# Altium schematic sheet loom-front-new.SchDoc
size 594 x 420 mm
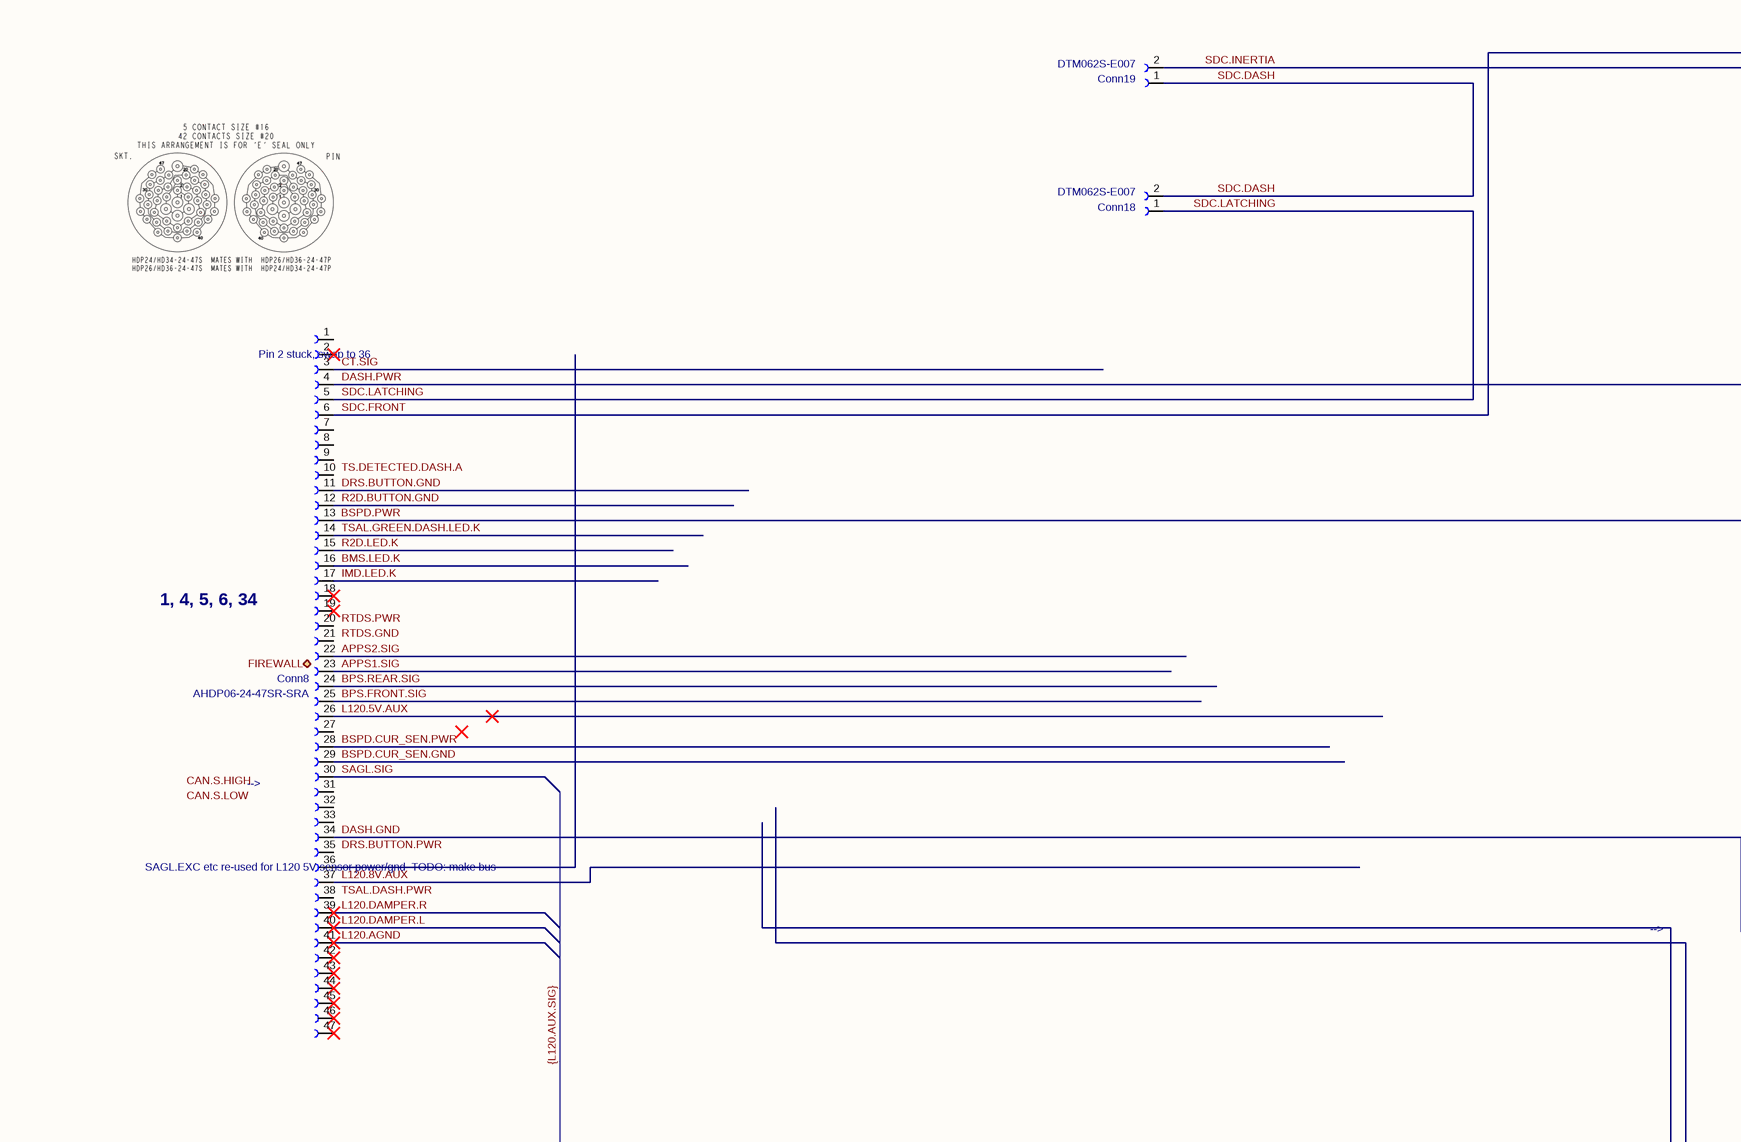
[diagram p0: loom-front-new.SchDoc, top left]
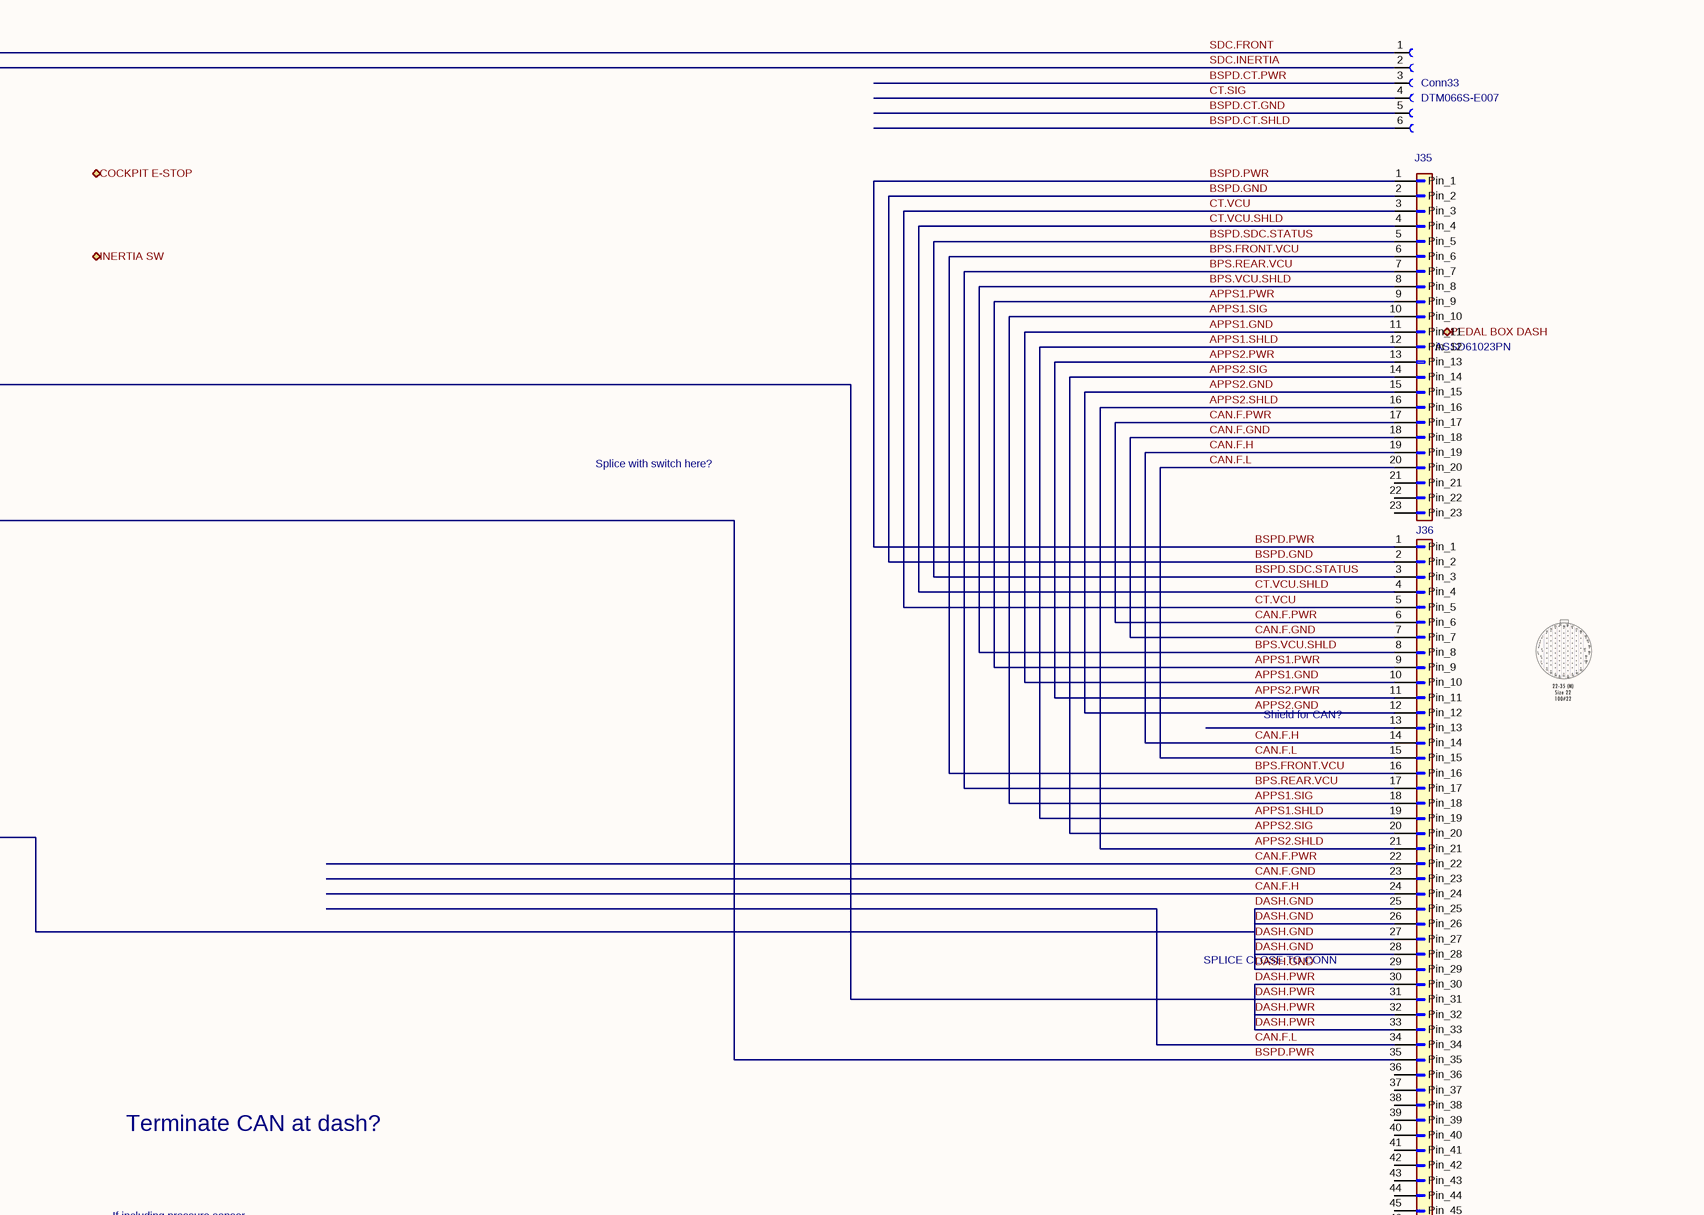
[diagram p1: loom-front-new.SchDoc, top right]
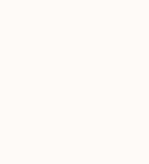
[diagram p2: loom-front-new.SchDoc, bottom left]
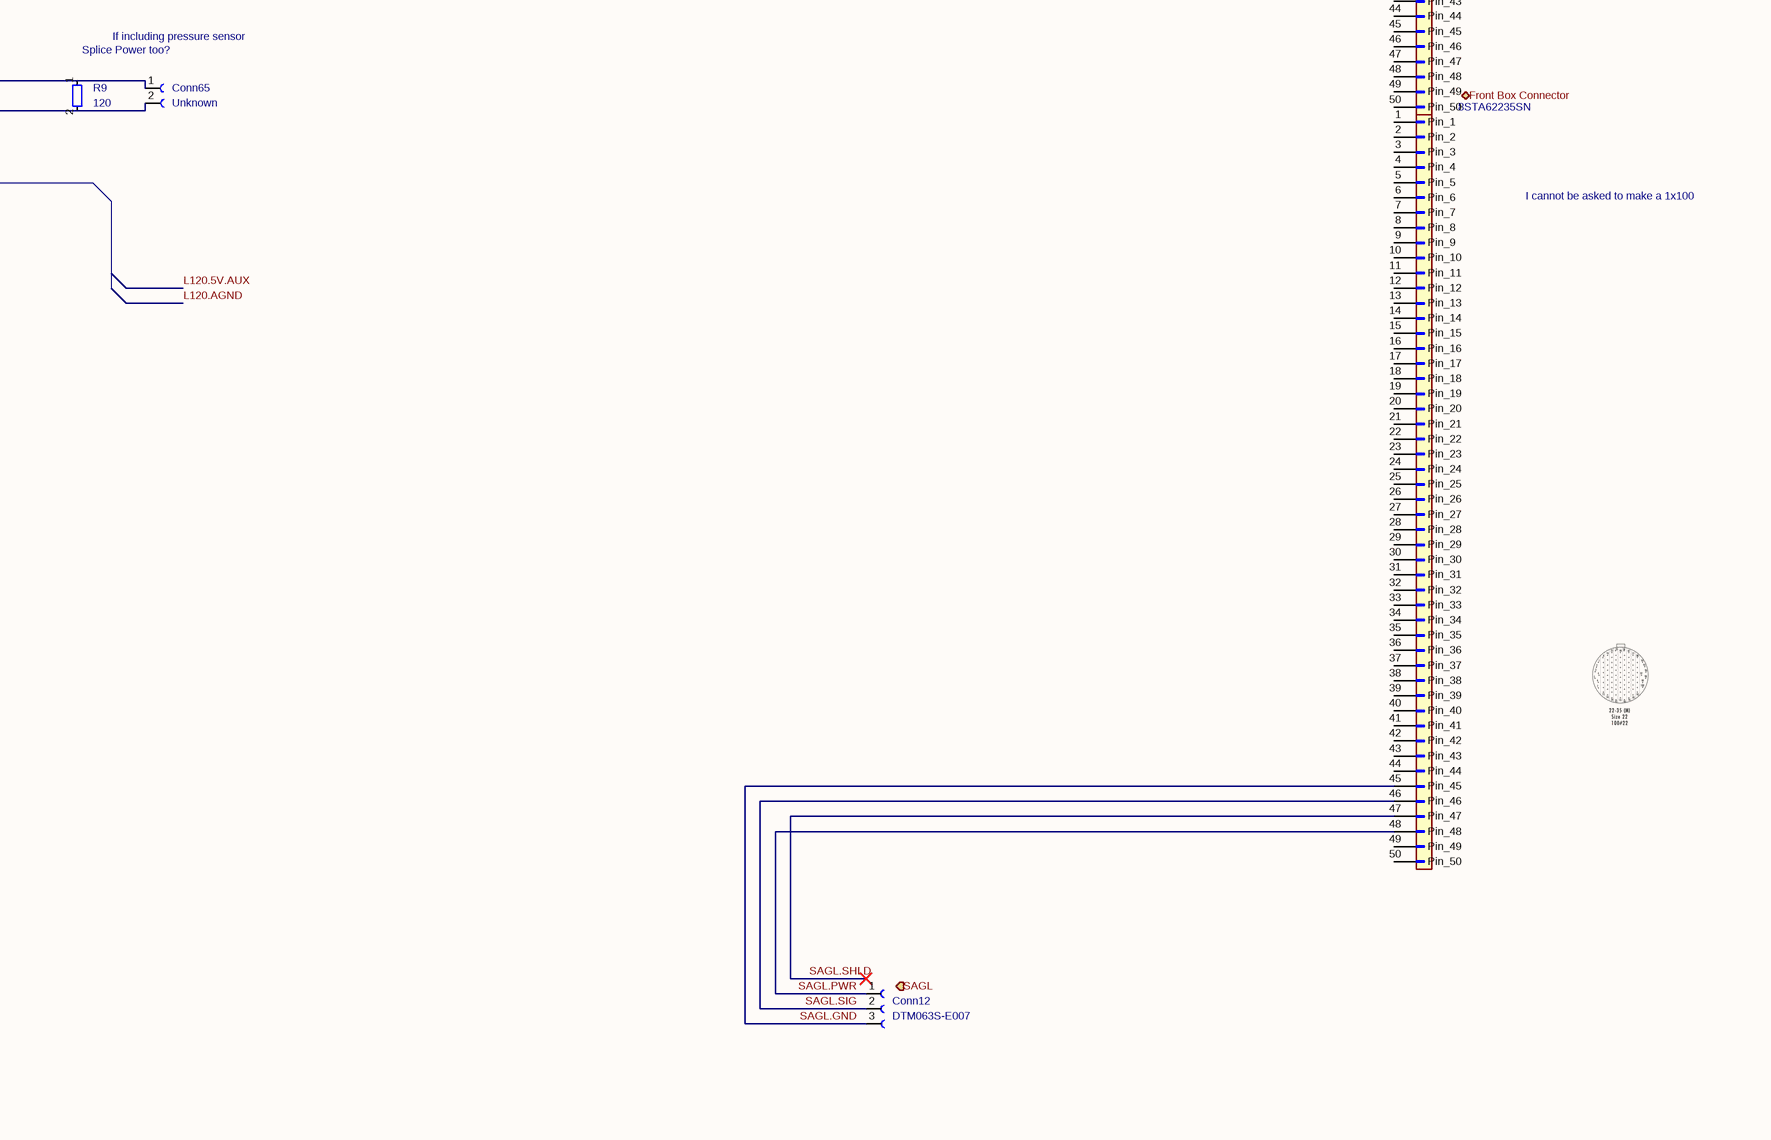
[diagram p3: loom-front-new.SchDoc, bottom right]

## Parts
Conn8  P/N: AHDP06-24-47SR-SRA  (hidden comment: AMPHENOL-47P-Recepticle)
Conn12  P/N: DTM063S-E007  (hidden comment: Deutsch_DTM_3S_Pin)
Conn18  P/N: DTM062S-E007  (hidden comment: Deutsch_DTM_2S_Pin)
Conn19  P/N: DTM062S-E007  (hidden comment: Deutsch_DTM_2S_Pin)
Conn33  P/N: DTM066S-E007  (hidden comment: Deutsch_DTM_6S_Pin)
Conn65  P/N: Unknown  (hidden comment: Deutsch_DTM_2S_Pin)
J35  ASSD61023PN
J36  8STA62235SN
J37  8STA02435PN  (value not drawn)
R9  120

## Ports
COCKPIT E-STOP (bidir), FIREWALL (bidir), Front Box Connector (bidir), INERTIA SW (bidir), PEDAL BOX DASH (bidir), SAGL (in)

## Nets
APPS1.GND: J35.11(Pin_11) J36.10(Pin_10)
APPS1.PWR: J35.9(Pin_9) J36.9(Pin_9)
APPS1.SHLD: J35.12(Pin_12) J36.19(Pin_19)
APPS1.SIG: Conn8.23 J35.10(Pin_10) J36.18(Pin_18)
APPS2.GND: J35.15(Pin_15) J36.12(Pin_12)
APPS2.PWR: J35.13(Pin_13) J36.11(Pin_11)
APPS2.SHLD: J35.16(Pin_16) J36.21(Pin_21)
APPS2.SIG: Conn8.22 J35.14(Pin_14) J36.20(Pin_20)
BMS.LED.K: Conn8.16
BPS.FRONT.SIG: Conn8.25
BPS.FRONT.VCU: J35.6(Pin_6) J36.16(Pin_16)
BPS.REAR.SIG: Conn8.24
BPS.REAR.VCU: J35.7(Pin_7) J36.17(Pin_17)
BPS.VCU.SHLD: J35.8(Pin_8) J36.8(Pin_8)
BSPD.CT.GND: Conn33.5
BSPD.CT.PWR: Conn33.3
BSPD.CT.SHLD: Conn33.6
BSPD.CUR_SEN.GND: Conn8.29
BSPD.CUR_SEN.PWR: Conn8.28
BSPD.GND: J35.2(Pin_2) J36.2(Pin_2)
BSPD.PWR: Conn8.13 J35.1(Pin_1) J36.1(Pin_1) J36.35(Pin_35)
BSPD.SDC.STATUS: J35.5(Pin_5) J36.3(Pin_3)
CAN.F.GND: J35.18(Pin_18) J36.7(Pin_7) J36.23(Pin_23)
CAN.F.H: J35.19(Pin_19) J36.14(Pin_14) J36.24(Pin_24)
CAN.F.L: J35.20(Pin_20) J36.15(Pin_15) J36.34(Pin_34)
CAN.F.PWR: J35.17(Pin_17) J36.6(Pin_6) J36.22(Pin_22)
CT.SIG: Conn8.3 Conn33.4
CT.VCU: J35.3(Pin_3) J36.5(Pin_5)
CT.VCU.SHLD: J35.4(Pin_4) J36.4(Pin_4)
DASH.GND: Conn8.34 J36.25(Pin_25) J36.26(Pin_26) J36.27(Pin_27) J36.28(Pin_28) J36.29(Pin_29)
DASH.PWR: Conn8.4 J36.30(Pin_30) J36.31(Pin_31) J36.32(Pin_32) J36.33(Pin_33)
DRS.BUTTON.GND: Conn8.11
IMD.LED.K: Conn8.17
L120.5V.AUX: Conn8.26
L120.8V.AUX: Conn8.37
L120.AGND: Conn8.41
L120.DAMPER.L: Conn8.40
L120.DAMPER.R: Conn8.39
R2D.BUTTON.GND: Conn8.12
R2D.LED.K: Conn8.15
SAGL.GND: Conn12.3 J37.45(Pin_45)
SAGL.PWR: Conn12.1 J37.48(Pin_48)
SAGL.SHLD: J37.47(Pin_47)
SAGL.SIG: Conn8.30 Conn12.2 J37.46(Pin_46)
SDC.DASH: Conn18.2 Conn19.1
SDC.FRONT: Conn8.6 Conn33.1
SDC.INERTIA: Conn19.2 Conn33.2
SDC.LATCHING: Conn8.5 Conn18.1
TSAL.GREEN.DASH.LED.K: Conn8.14
NetConn65_1: Conn65.1 R9.1
NetConn65_2: Conn65.2 R9.2

Not connected (* = marked no-connect by the designer): Conn8 1 2* 7 8 9 10 18* 19* 20 21 27 31 32 33 35 36 38 42* 43* 44* 45* 46* 47*; J35 21(Pin_21) 22(Pin_22) 23(Pin_23); J36 13(Pin_13) 36(Pin_36) 37(Pin_37) 38(Pin_38) 39(Pin_39) 40(Pin_40) 41(Pin_41) 42(Pin_42) 43(Pin_43) 44(Pin_44) 45(Pin_45) 46(Pin_46) 47(Pin_47) 48(Pin_48) 49(Pin_49) 50(Pin_50); J37 1(Pin_1) 2(Pin_2) 3(Pin_3) 4(Pin_4) 5(Pin_5) 6(Pin_6) 7(Pin_7) 8(Pin_8) 9(Pin_9) 10(Pin_10) 11(Pin_11) 12(Pin_12) 13(Pin_13) 14(Pin_14) 15(Pin_15) 16(Pin_16) 17(Pin_17) 18(Pin_18) 19(Pin_19) 20(Pin_20) 21(Pin_21) 22(Pin_22) 23(Pin_23) 24(Pin_24) 25(Pin_25) 26(Pin_26) 27(Pin_27) 28(Pin_28) 29(Pin_29) 30(Pin_30) 31(Pin_31) 32(Pin_32) 33(Pin_33) 34(Pin_34) 35(Pin_35) 36(Pin_36) 37(Pin_37) 38(Pin_38) 39(Pin_39) 40(Pin_40) 41(Pin_41) 42(Pin_42) 43(Pin_43) 44(Pin_44) 49(Pin_49) 50(Pin_50)

## Buses and harness runs
bus {L120.AUX.SIG}

## Notes on the sheet
- (near Conn8) Pin 2 stuck,
  swap to 36
- Splice with switch here?
- (near Conn8) 1, 4, 5, 6, 34
- Shield for CAN?
- (near Conn8) -->
- (near Conn8) SAGL.EXC etc re-used
  for L120 5V sensor
  power/gnd
  TODO: make bus
- -->
- SPLICE CLOSE
  TO CONN
- Terminate CAN at dash?
- If including pressure sensor
- Splice Power too?
- I cannot be asked
  to make a 1x100
- Labels drawn without touching a wire or pin: CAN.S.HIGH, CAN.S.LOW, DRS.BUTTON.PWR, RTDS.GND, RTDS.PWR, TS.DETECTED.DASH.A, TSAL.DASH.PWR
- 1
- 2
- 3
- 4
- 5
- 6
- 7
- 8
- 9
- 10
- 11
- A
- B
- C
- D
- E
- F
- G
- H
- Title:
- File: loom-front-new.kicad_sch
- Sheet: /
- KiCad E.D.A.  kicad (5.1.4)-1
- Size: A2
- Date:
- Rev:
- Id: 1/1

## Library data of the parts
J35 = Conn_01x23: Description: Generic connector, single row, 01x23, script generated (kicad-library-utils/schlib/autogen/connector/); Value: ASSD61023PN
J36 J37 = Conn_01x50: Description: "Generic connector, single row, 01x50, script generated"
  J36: Value: 8STA62235SN
  J37: Value: 8STA02435PN
R9 = R_Small: Description: Resistor, small symbol; Value: 120
Conn8 = AMPHENOL-47P-Recepticle: Value: AMPHENOL-47P-Recepticle
Conn12 = Deutsch_DTM_3S_Pin: Value: Deutsch_DTM_3S_Pin
Conn18 Conn19 Conn65 = Deutsch_DTM_2S_Pin: Value: Deutsch_DTM_2S_Pin
Conn33 = Deutsch_DTM_6S_Pin: Value: Deutsch_DTM_6S_Pin